# Altium project pca10156.PrjPCB (part 2 of 4)

## Sheet pca10156_sheet3_debugger.SchDoc: =BoardTitle+' - Debugger'
size A3; Organization: Nordic Semiconductor; DocumentNumber: 3; Revision: 1.0.0; SheetNumber: 3; SheetTotal: 8; Author: STL1; CompanyName: Nordic Semiconductor; DrawnBy: STL1; DocumentSize: A4
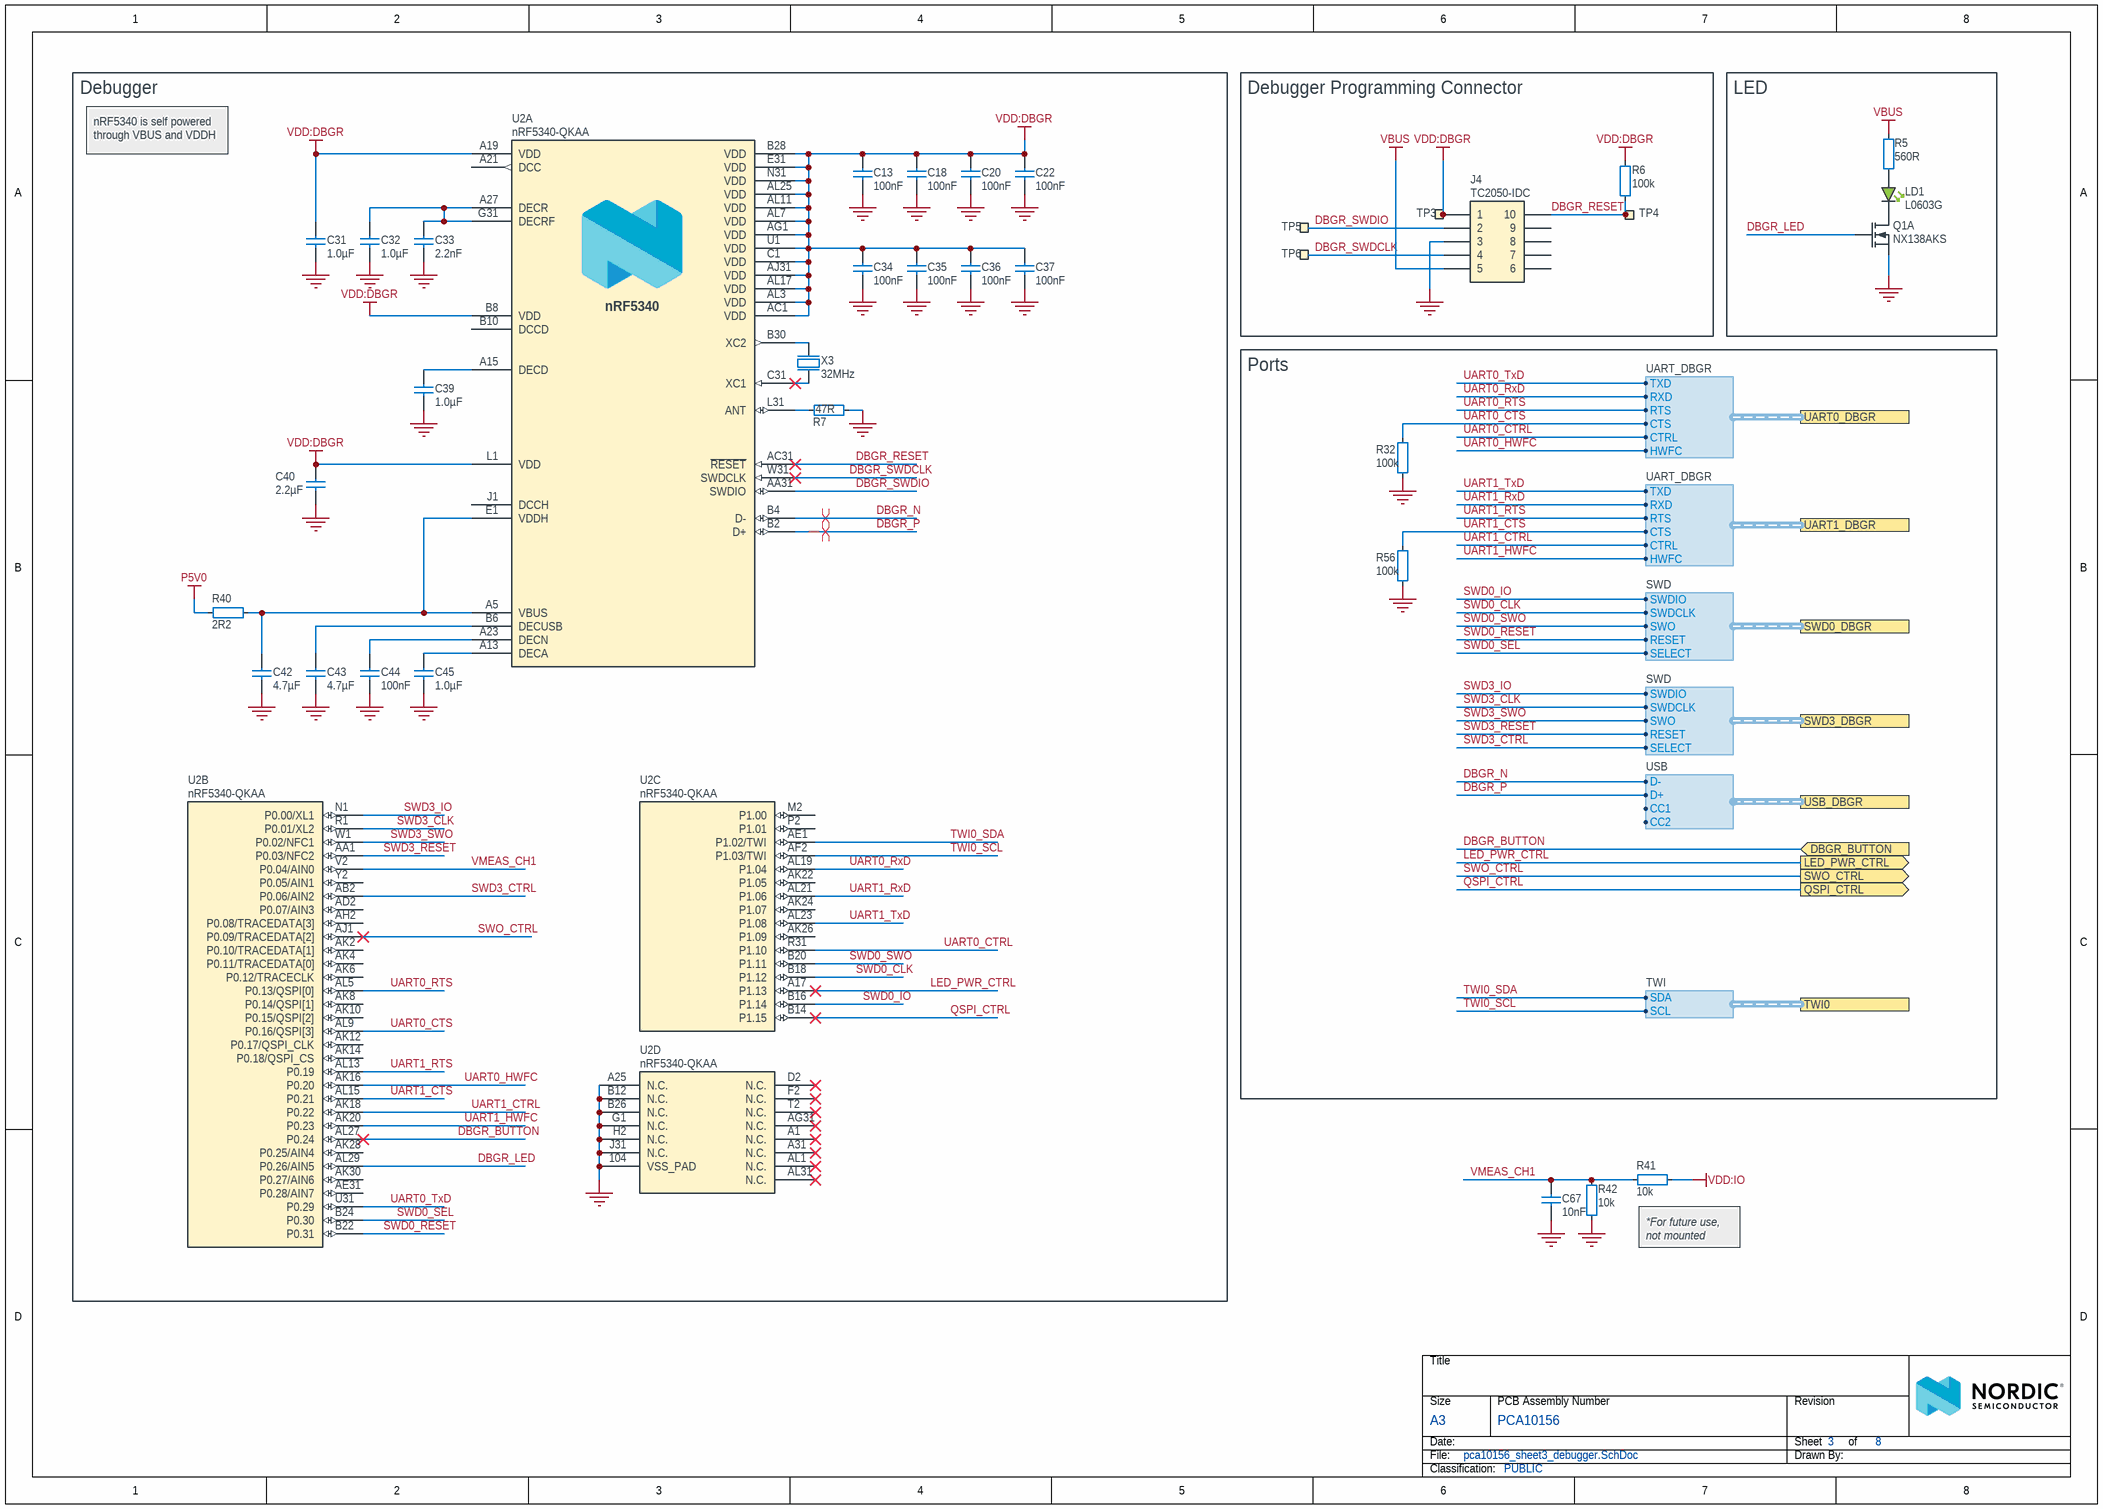
[diagram p2: pca10156_sheet3_debugger.SchDoc]

### Parts
C13  100nF  [CAPC0603X03L_C]
C18  100nF  [CAPC0603X03L_C]
C20  100nF  [CAPC0603X03L_C]
C22  100nF  [CAPC0603X03L_C]
C31  1.0µF  [CAPC1005X04L]
C32  1.0µF  [CAPC1005X04L]
C33  2.2nF  [CAPC0603X03L_C]
C34  100nF  [CAPC0603X03L_C]
C35  100nF  [CAPC0603X03L_C]
C36  100nF  [CAPC0603X03L_C]
C37  100nF  [CAPC0603X03L_C]
C39  1.0µF  [CAPC1005X04L]
C40  2.2µF  [CAPC1608X06L]
C42  4.7µF  [CAPC1608X06L]
C43  4.7µF  [CAPC1608X06L]
C44  100nF  [CAPC0603X03L_C]
C45  1.0µF  [CAPC1005X04L]
C67  10nF  [CAPC0603X03L_C]
J4  TC2050-IDC  [TC2050-IDC-NLFP]  (no BOM)
LD1  L0603G  [LED_0603_G]
Q1  NX138AKS  [TSSOP6]  (part A of 2)
R5  560R  [RESC0603X03L_C]
R6  100k  [RESC0603X03L_C]
R7  47R  [RESC0603X03L_C]
R32  100k  [RESC0603X03L_C]
R40  2R2  [RESC0603X03L_C]
R41  10k  [RESC0603X03L_C]
R42  10k  [RESC0603X03L_C]
R56  100k  [RESC0603X03L_C]
TP3  Ø1.5mm,SMD  [TP_SMD_D1.5mm]  (value not drawn)  (no BOM)
TP4  Ø1.5mm,SMD  [TP_SMD_D1.5mm]  (value not drawn)  (no BOM)
TP5  Ø1.5mm,SMD  [TP_SMD_D1.5mm]  (value not drawn)  (no BOM)
TP6  Ø1.5mm,SMD  [TP_SMD_D1.5mm]  (value not drawn)  (no BOM)
U2  nRF5340-QKAA  [AQFN40P700X700X85_HS-99N]  (parts A,B,C,D of 4)
X3  32MHz  [BT-XTAL_2016]

### Blocks framed on the sheet
Debugger: C13 C18 C20 C22 C31-C37 C39 C40 C42-C45 R7 R40 U2 X3
Debugger Programming Connector: J4 R6 TP3-TP6
LED: LD1 Q1 R5
Ports: R32 R56

### Ports
DBGR_BUTTON (in), LED_PWR_CTRL (out), QSPI_CTRL (out), SWD0_DBGR (harness SWD), SWD3_DBGR (harness SWD), SWO_CTRL (out), TWI0 (harness TWI), UART0_DBGR (harness UART_DBGR), UART1_DBGR (harness UART_DBGR), USB_DBGR (harness USB)

### Harnesses
SWD: SWDIO, SWDCLK, SWO, RESET, SELECT
UART_DBGR: RTS, CTS, RXD, TXD, HWFC, CTRL
TWI: SCL, SDA
USB: D+, D-, CC1, CC2

### Nets
GND: C13.2 C18.2 C20.2 C22.2 C31.2 C32.1 C33.2 C34.2 C35.2 C36.2 C37.2 C39.1 C40.2 C42.2 C43.2 C44.2 C45.1 C67.2 J4.3 Q1.1(S1) R7.2 R32.2 R42.1 R56.2 U2.104(VSS_PAD) U2.A25(N.C.) U2.B12(N.C.) U2.B26(N.C.) U2.G1(N.C.) U2.H2(N.C.) U2.J31(N.C.) X3.2(GND) X3.4(GND)
P5V0: R40.2
VBUS: J4.5 R5.2
VDD:DBGR: C13.1 C18.1 C20.1 C22.1 C31.1 C34.1 C35.1 C36.1 C37.1 C40.1 J4.1 R6.2 TP3.1 U2.A19(VDD) U2.AC1(VDD) U2.AG1(VDD) U2.AJ31(VDD) U2.AL3(VDD) U2.AL7(VDD) U2.AL11(VDD) U2.AL17(VDD) U2.AL25(VDD) U2.B8(VDD) U2.B28(VDD) U2.C1(VDD) U2.E31(VDD) U2.L1(VDD) U2.N31(VDD) U2.U1(VDD)
VDD:IO: R41.2
DBGR_BUTTON: U2.AL27(P0.24) ; port DBGR_BUTTON
DBGR_LED: Q1.2(G1) U2.AL29(P0.26/AIN5)
DBGR_N: U2.B4(D-) ; port USB_DBGR.D-
DBGR_P: U2.B2(D+) ; port USB_DBGR.D+
DBGR_RESET: J4.10 R6.1 TP4.1 U2.AC31(~{RESET})
DBGR_SWDCLK: J4.4 TP6.1 U2.W31(SWDCLK)
DBGR_SWDIO: J4.2 TP5.1 U2.AA31(SWDIO)
LED_PWR_CTRL: U2.A17(P1.13) ; port LED_PWR_CTRL
QSPI_CTRL: U2.B14(P1.15) ; port QSPI_CTRL
SWD0_CLK: U2.B18(P1.12) ; port SWD0_DBGR.SWDCLK
SWD0_IO: U2.B16(P1.14) ; port SWD0_DBGR.SWDIO
SWD0_RESET: U2.B22(P0.31) ; port SWD0_DBGR.RESET
SWD0_SEL: U2.B24(P0.30) ; port SWD0_DBGR.SELECT
SWD0_SWO: U2.B20(P1.11) ; port SWD0_DBGR.SWO
SWD3_CLK: U2.R1(P0.01/XL2) ; port SWD3_DBGR.SWDCLK
SWD3_CTRL: U2.AB2(P0.06/AIN2) ; port SWD3_DBGR.SELECT
SWD3_IO: U2.N1(P0.00/XL1) ; port SWD3_DBGR.SWDIO
SWD3_RESET: U2.AA1(P0.03/NFC2) ; port SWD3_DBGR.RESET
SWD3_SWO: U2.W1(P0.02/NFC1) ; port SWD3_DBGR.SWO
SWO_CTRL: U2.AJ1(P0.09/TRACEDATA[2]) ; port SWO_CTRL
TWI0_SCL: U2.AF2(P1.03/TWI) ; port TWI0.SCL
TWI0_SDA: U2.AE1(P1.02/TWI) ; port TWI0.SDA
UART0_CTRL: U2.R31(P1.10) ; port UART0_DBGR.CTRL
UART0_CTS: R32.1 U2.AL9(P0.16/QSPI[3]) ; port UART0_DBGR.CTS
UART0_HWFC: U2.AK16(P0.20) ; port UART0_DBGR.HWFC
UART0_RTS: U2.AL5(P0.13/QSPI[0]) ; port UART0_DBGR.RTS
UART0_RxD: U2.AL19(P1.04) ; port UART0_DBGR.RXD
UART0_TxD: U2.U31(P0.29) ; port UART0_DBGR.TXD
UART1_CTRL: U2.AK18(P0.22) ; port UART1_DBGR.CTRL
UART1_CTS: R56.1 U2.AL15(P0.21) ; port UART1_DBGR.CTS
UART1_HWFC: U2.AK20(P0.23) ; port UART1_DBGR.HWFC
UART1_RTS: U2.AL13(P0.19) ; port UART1_DBGR.RTS
UART1_RxD: U2.AL21(P1.06) ; port UART1_DBGR.RXD
UART1_TxD: U2.AL23(P1.08) ; port UART1_DBGR.TXD
VMEAS_CH1: C67.1 R41.1 R42.2 U2.V2(P0.04/AIN0)
NetC32_2: C32.2 C33.1 U2.A27(DECR) U2.G31(DECRF)
NetC39_2: C39.2 U2.A15(DECD)
NetC42_1: C42.1 R40.1 U2.A5(VBUS) U2.E1(VDDH)
NetC43_1: C43.1 U2.B6(DECUSB)
NetC44_1: C44.1 U2.A23(DECN)
NetC45_2: C45.2 U2.A13(DECA)
NetLD1_1: LD1.1(C) Q1.6(D1)
NetLD1_2: LD1.2(A) R5.1
NetR7_1: R7.1 U2.L31(ANT)
NetU2_B30: U2.B30(XC2) X3.3(out)
NetU2_C31: U2.C31(XC1) X3.1(inp)

Not connected (* = marked no-connect by the designer): J4 6 7 8 9; U2 A1(N.C.)* A21(DCC) A31(N.C.)* AD2(P0.07/AIN3) AE31(P0.28/AIN7) AG31(N.C.)* AH2(P0.08/TRACEDATA[3]) AK2(P0.10/TRACEDATA[1]) AK4(P0.11/TRACEDATA[0]) AK6(P0.12/TRACECLK) AK8(P0.14/QSPI[1]) AK10(P0.15/QSPI[2]) AK12(P0.17/QSPI_CLK) AK14(P0.18/QSPI_CS) AK22(P1.05) AK24(P1.07) AK26(P1.09) AK28(P0.25/AIN4) AK30(P0.27/AIN6) AL1(N.C.)* AL31(N.C.)* B10(DCCD) D2(N.C.)* F2(N.C.)* J1(DCCH) M2(P1.00) P2(P1.01) T2(N.C.)* Y2(P0.05/AIN1)

### Layout directives
differential pair; differential pair class DBGR; net class DBGR_USB: DBGR_N, DBGR_P

### Notes on the sheet
- nRF5340 is self powered through VBUS and VDDH
- (near R41) *For future use, not mounted
- Title
- Size
- Date:
- File:
- A3
- PCB Assembly Number
- Sheet
- Drawn By:
- Revision
- of
- Classification:
- (in symbol nRF5340-QKAAD0, part A) nRF5340

### Library data of the parts
C13 C18 C20 C22 C34-C37 C44 = C0201-100n: Capacitor, X5R, ±10%; Manufacturer: N.A.; Part number IPS: 00000001248, 00000002505; Part number Norautron: 262071862; Part number NEMS: 100200078; Pad Count: 2; Note: 16V; Component Status: Active; Part Number: C0201-100n; Value: 100nF; Footprint Doc: 0201; Component Class: Capacitors; Author: rsk; PartId: 100200078; Manufacturer Part Number: N.A.; ComponentLink1URL: N.A.; ComponentLink1Description: Datasheet; ComponentLink2URL: N.A.; ComponentLink2Description: Supplier link; HelpURL: N.A.; LatestRevisionDate: 2017-11-09; Published: 2014-11-13; Supplier 1: N.A.; Supplier Part Number 1: N.A.; Supplier 2: N.A.; Supplier Part Number 2: N.A.; Artikkelnr Noca: N.A.
C31 C32 C39 C45 = C0402-1µ0-6.3V-X5R-10%: Capacitor, X5R, ±10%, 6.3V; Manufacturer: N.A.; Part number Norautron: 26207137; Part number NEMS: 100200498; Pad Count: 2; Component Status: Active; Part Number: C0402-1µ0-6.3V-X5R-10%; Manufacturer Part Number: N.A.; LatestRevisionDate: 2022-01-27; Published: 2022-01-27; Value: 1.0µF; Note: 6.3V; Artikkelnr Noca: N.A.; Footprint Doc: 0402; ComponentLink1URL: N.A.; ComponentLink1Description: Datasheet; ComponentLink2URL: N.A.; ComponentLink2Description: Supplier link; HelpURL: N.A.; Supplier 1: N.A.; Supplier Part Number 1: N.A.; Supplier 2: N.A.; Supplier Part Number 2: N.A.; Part number IPS: N.A.; Component Class: Capacitors; PartId: 100200498; Author: rubr
C33 = C0201-2n2: Capacitor, X7R, ±10%, 10V; Manufacturer: N.A.; Part number IPS: 00000001778; Part number Norautron: 26470002; Part number NEMS: 100200060; Pad Count: 2; Component Status: Active; Part Number: C0201-2n2; LatestRevisionDate: 2014-11-13; Published: 2014-11-13; Value: 2.2nF; Footprint Doc: 0201; Manufacturer Part Number: N.A.; ComponentLink1URL: N.A.; ComponentLink1Description: Datasheet; ComponentLink2URL: N.A.; ComponentLink2Description: Supplier link; HelpURL: N.A.; Note: 10V; Supplier 1: N.A.; Supplier Part Number 1: N.A.; Supplier 2: N.A.; Supplier Part Number 2: N.A.; Artikkelnr Noca: N.A.; Component Class: Capacitors; PartId: 100200060; Author: rsk
C40 = C0603-2µ2-6.3V-X7R: Capacitor, X7R, ±10%, 6.3V; Manufacturer: N.A.; Part number NEMS: 100200272; Artikkelnr Noca: 20039322; Pad Count: 2; Component Status: Active; Part Number: C0603-2µ2-6.3V-X7R; Manufacturer Part Number: N.A.; LatestRevisionDate: 2021-07-22; Published: 2009-05-08; Value: 2.2µF; Note: 6.3V; Footprint Doc: 0603; ComponentLink1URL: N.A.; ComponentLink1Description: Datasheet; ComponentLink2URL: N.A.; ComponentLink2Description: Supplier link; HelpURL: N.A.; Supplier 1: N.A.; Supplier Part Number 1: N.A.; Supplier 2: N.A.; Supplier Part Number 2: N.A.; Part number IPS: N.A.; Component Class: Capacitors; PartId: 100200272; Author: rsk; Part number Norautron: N.A.
C42 C43 = C0603-4µ7-10V-X7S: Capacitor, X7S, ±10%, 10V; Manufacturer: N.A.; Part number IPS: 00000001779; Part number NEMS: 100200351; Pad Count: 2; Artikkelnr Noca: 20030013; Component Status: Active; Part Number: C0603-4µ7-10V-X7S; Value: 4.7µF; Footprint Doc: 0603; Component Class: Capacitors; Author: rsk; PartId: 100200351; Manufacturer Part Number: N.A.; ComponentLink1URL: N.A.; ComponentLink1Description: Datasheet; ComponentLink2URL: N.A.; ComponentLink2Description: Supplier link; HelpURL: N.A.; LatestRevisionDate: 2016-08-15; Published: 2016-08-15; Note: 10V; Supplier 1: Digi-Key; Supplier Part Number 1: 445-14258-1-ND; Supplier 2: N.A.; Supplier Part Number 2: N.A.; Part number Norautron: N.A.
C67 = C0201-10n: Capacitor, X7R, ±10%; Manufacturer: N.A.; Part number IPS: 00000003480; Part number Norautron: 26621779; Part number NEMS: 100200067; Note: 10V; Assembly: Not Mounted; Pad Count: 2; Component Status: Active; Part Number: C0201-10n; Manufacturer Part Number: N.A.; LatestRevisionDate: 2017-11-09; Published: 2014-11-13; Value: 10nF; Artikkelnr Noca: N.A.; Footprint Doc: 0201; ComponentLink1URL: N.A.; ComponentLink1Description: Datasheet; ComponentLink2URL: N.A.; ComponentLink2Description: Supplier link; HelpURL: N.A.; Supplier 1: N.A.; Supplier Part Number 1: N.A.; Supplier 2: N.A.; Supplier Part Number 2: N.A.; Component Class: Capacitors; PartId: 100200067; Author: rsk
J4 = TC2050-IDC-NLFP: CBL PLUG-OF-NAILS 10-PIN; Manufacturer: Tag-Connect LLC; Part number NEMS: 100500463; Artikkelnr Noca: N.A.; Pad Count: 10; Component Status: Active; System: Connector; Part Number: TC2050-IDC-NLFP; Manufacturer Part Number: TC2050-IDC-NLFP; LatestRevisionDate: 2012-11-21; Published: 2012-11-21; Value: TC2050-IDC; Footprint Doc: TC2050-IDC-NLFP; Part number IPS: N.A.; ComponentLink1URL: N.A.; ComponentLink1Description: Datasheet; ComponentLink2URL: N.A.; ComponentLink2Description: Supplier link; HelpURL: http://www.tag-connect.com/Materials/TC2050-IDC%20Datasheet.pdf; Supplier 1: Digi-Key; Supplier Part Number 1: TC2050-IDC-NL-ND; Supplier 2: N.A.; Supplier Part Number 2: N.A.; Component Class: Connectors; Note: N.A.; PartId: 100500463; Author: rsk; Part number Norautron: N.A.
LD1 = VS 25C7M5: LED, Green, 0603, 573nm, Vf=2.0V, 24mcd, - 40 to +85°C; Manufacturer: Victory Electronics; Part number IPS: 00000001274, 00000009961; Part number Norautron: 26313411; Part number NEMS: 101400097; Pad Count: 2; Note: N.A.; Artikkelnr Noca: 13019193; Component Status: Active; Part Number: VS 25C7M5; PartId: 101400097; Component Class: Optoelectronics; Author: rsk; Manufacturer Part Number: VS 25C7M5; ComponentLink1URL: N.A.; ComponentLink1Description: Datasheet; ComponentLink2URL: N.A.; ComponentLink2Description: Supplier link; HelpURL: \\hizz\pro\app9717\Datasheet\optoelectronics\Victory Electronics\VS 25C7M5.pdf; Footprint Doc: 0603; LatestRevisionDate: 2020-10-23; Published: 2017-08-21; Value: L0603G; Supplier 1: EC Partner; Supplier Part Number 1: N.A.; Supplier 2: N.A.; Supplier Part Number 2: N.A.
Q1 = NX138AKS: MOSFET 2N-CH 60V 0.17A TSSOP6 (SOT363); Manufacturer: Nexperia; Manufacturer Part Number: NX138AKSX; Part number NEMS: 101300207; Component Status: Active; Pad Count: 6; Note: N.A.; Part Number: NX138AKS; Component Class: Semiconductors; Author: stl1; ComponentLink1URL: https://assets.nexperia.com/documents/data-sheet/NX138AKS.pdf; ComponentLink1Description: Datasheet; ComponentLink2URL: N.A.; ComponentLink2Description: Supplier link; HelpURL: N.A.; LatestRevisionDate: 2023-11-20; Published: 2023-11-20; Footprint Doc: TSSOP6; Value: NX138AKS; Supplier 1: Digi-Key; Supplier Part Number 1: 1727-2732-2-ND; Supplier 2: Mouser; Supplier Part Number 2: 771-NX138AKSX; Artikkelnr Noca: N.A.; Part number IPS: N.A.; Part number Norautron: N.A.; PartId: 101300207
R5 = R0201-560: Resistor, ±1%, 0.05W; Manufacturer: N.A.; Part number NEMS: 100100038; Note: Chip Res 1%; Pad Count: 2; Component Status: Active; Part Number: R0201-560; Manufacturer Part Number: N.A.; ComponentLink1URL: N.A.; ComponentLink1Description: Datasheet; ComponentLink2URL: N.A.; ComponentLink2Description: Supplier link; HelpURL: N.A.; Footprint Doc: 0201; LatestRevisionDate: 2014-11-13; Published: 2014-11-13; Value: 560R; Supplier 1: N.A.; Supplier Part Number 1: N.A.; Supplier 2: N.A.; Supplier Part Number 2: N.A.; Artikkelnr Noca: N.A.; Part number IPS: N.A.; PartId: 100100038; Component Class: Resistors; Author: rsk; Part number Norautron: N.A.
R6 R32 R56 = R0201-100k: Resistor, ±1%, 0.05W; Manufacturer: N.A.; Part number IPS: 00000001419; Part number Norautron: 26108487; Part number NEMS: 100100080; Note: Chip Res 1%; Pad Count: 2; Component Status: Active; Part Number: R0201-100k; Manufacturer Part Number: N.A.; ComponentLink1URL: N.A.; ComponentLink1Description: Datasheet; ComponentLink2URL: N.A.; ComponentLink2Description: Supplier link; HelpURL: N.A.; Footprint Doc: 0201; LatestRevisionDate: 2014-11-13; Published: 2014-11-13; Value: 100k; Artikkelnr Noca: N.A.; Supplier 1: N.A.; Supplier Part Number 1: N.A.; Supplier 2: N.A.; Supplier Part Number 2: N.A.; Component Class: Resistors; PartId: 100100080; Author: rsk
R7 = R0201-47R: Resistor, ±1%, 0.05W; Manufacturer: N.A.; Part number IPS: 00000004794; Part number Norautron: 26108300; Part number NEMS: 100100022; Component Status: Active; Pad Count: 2; Note: Chip Res 1%; Part Number: R0201-47R; PartId: 100100022; Component Class: Resistors; Author: rsk; Manufacturer Part Number: N.A.; ComponentLink1URL: N.A.; ComponentLink1Description: Datasheet; ComponentLink2URL: N.A.; ComponentLink2Description: Supplier link; HelpURL: N.A.; LatestRevisionDate: 2014-11-13; Published: 2014-11-13; Footprint Doc: 0201; Value: 47R; Supplier 1: N.A.; Supplier Part Number 1: N.A.; Supplier 2: N.A.; Supplier Part Number 2: N.A.; Artikkelnr Noca: N.A.
R40 = R0201-2R2: Resistor, ±1%, 0.05W; Manufacturer: N.A.; Part number Norautron: 26470029; Part number NEMS: 100100006; Pad Count: 2; Note: Chip Res 1%; Component Status: Active; Part Number: R0201-2R2; Footprint Doc: 0201; Value: 2R2; Component Class: Resistors; Author: rsk; PartId: 100100006; Manufacturer Part Number: N.A.; ComponentLink1URL: N.A.; ComponentLink1Description: Datasheet; ComponentLink2URL: N.A.; ComponentLink2Description: Supplier link; HelpURL: N.A.; LatestRevisionDate: 2014-11-13; Published: 2014-11-13; Supplier 1: N.A.; Supplier Part Number 1: N.A.; Supplier 2: N.A.; Supplier Part Number 2: N.A.; Artikkelnr Noca: N.A.; Part number IPS: N.A.
R41 R42 = R0201-10k: Resistor, ±1%, 0.05W; Manufacturer: N.A.; Part number IPS: 00000001255; Part number Norautron: 26107101; Part number NEMS: 100100065; Component Status: Active; Pad Count: 2; Note: Chip Res 1%; Part Number: R0201-10k; PartId: 100100065; Component Class: Resistors; Author: rsk; Manufacturer Part Number: N.A.; ComponentLink1URL: N.A.; ComponentLink1Description: Datasheet; ComponentLink2URL: N.A.; ComponentLink2Description: Supplier link; HelpURL: N.A.; LatestRevisionDate: 2014-11-13; Published: 2014-11-13; Footprint Doc: 0201; Value: 10k; Supplier 1: N.A.; Supplier Part Number 1: N.A.; Supplier 2: N.A.; Supplier Part Number 2: N.A.; Artikkelnr Noca: N.A.
TP3-TP6 = TP_SMD_Ø1.5MM: 1.5mm circular SMD testpad; Manufacturer: Nordic Semiconductor; Manufacturer Part Number: N.A.; Part number NEMS: 100500477; Pad Count: 1; Component Status: Active; Part Number: TP_SMD_Ø1.5MM; ComponentLink1URL: N.A.; ComponentLink1Description: Datasheet; ComponentLink2URL: N.A.; ComponentLink2Description: Supplier link; HelpURL: N.A.; Footprint Doc: TP_SMD_Ø1.5mm; LatestRevisionDate: 2021-03-05; Published: 2016-06-02; Value: Ø1.5mm,SMD; Note: N.A.; Artikkelnr Noca: N.A.; Part number IPS: N.A.; Supplier 1: N.A.; Supplier Part Number 1: N.A.; Supplier 2: N.A.; Supplier Part Number 2: N.A.; Component Class: Connectors; PartId: 100500477; Author: rsk; Part number Norautron: N.A.
U2 = nRF5340-QKAAD0: Multi-protocol Bluetooth Low Energy, IEEE 802.15.4, ANT and 2.4GHz proprietary system-on-chip; Manufacturer: Nordic Semiconductor; Part number Norautron: NOD26470035; Part number NEMS: 102000216; Pad Count: 98; Note: N.A.; Component Status: Active; Part Number: nRF5340-QKAAD0; Footprint Doc: AQFN-98; Value: nRF5340-QKAA; Component Class: Nordic_Devices; Author: rsk; PartId: 102000216; Manufacturer Part Number: nRF5340-QKAAD0; ComponentLink1URL: N.A.; ComponentLink1Description: Datasheet; ComponentLink2URL: N.A.; ComponentLink2Description: Supplier link; HelpURL: N.A.; LatestRevisionDate: 2020-12-02; Published: 2020-12-02; Supplier 1: Nordic Semiconductor; Supplier Part Number 1: nRF5340-QKAAD0; Supplier 2: N.A.; Supplier Part Number 2: N.A.; Artikkelnr Noca: N.A.; Part number IPS: N.A.
X3 = XTAL_SMD2016_32MHz_8pF_Golledge: XTAL SMD 2016, 32MHz, Cl=8pF, Tol: ±10ppm, Stab: ±15ppm; Manufacturer Part Number: MP06003; Part number IPS: 00000001431; Part number Norautron: N.A.; Part number NEMS: 101600041; Component Status: Active; Pad Count: 4; Note: XTAL SMD 32.000MHz; Artikkelnr Noca: 22010050; Part Number: XTAL_SMD2016_32MHz_8pF_Golledge; PartId: 101600041; Component Class: Oscillators; Author: rsk; Manufacturer: Golledge; ComponentLink1URL: N.A.; ComponentLink1Description: Datasheet; ComponentLink2URL: N.A.; ComponentLink2Description: Supplier link; HelpURL: \\hizz\pro\app9717\Datasheet\crystals\Golledge\mp06003.pdf; LatestRevisionDate: 2016-11-02; Published: 2016-11-02; Footprint Doc: XTAL_2016; Value: 32MHz; Supplier 1: Link Nordic; Supplier Part Number 1: N.A.; Supplier 2: N.A.; Supplier Part Number 2: N.A.

## Sheet pca10156_sheet4_level_shifters.SchDoc: =BoardTitle+' - Level Shifters'
size A3; Organization: Nordic Semiconductor; DocumentNumber: 4; Revision: 1.0.0; SheetNumber: 4; SheetTotal: 8; Author: STL1; CompanyName: Nordic Semiconductor; DrawnBy: STL1; DocumentSize: A4
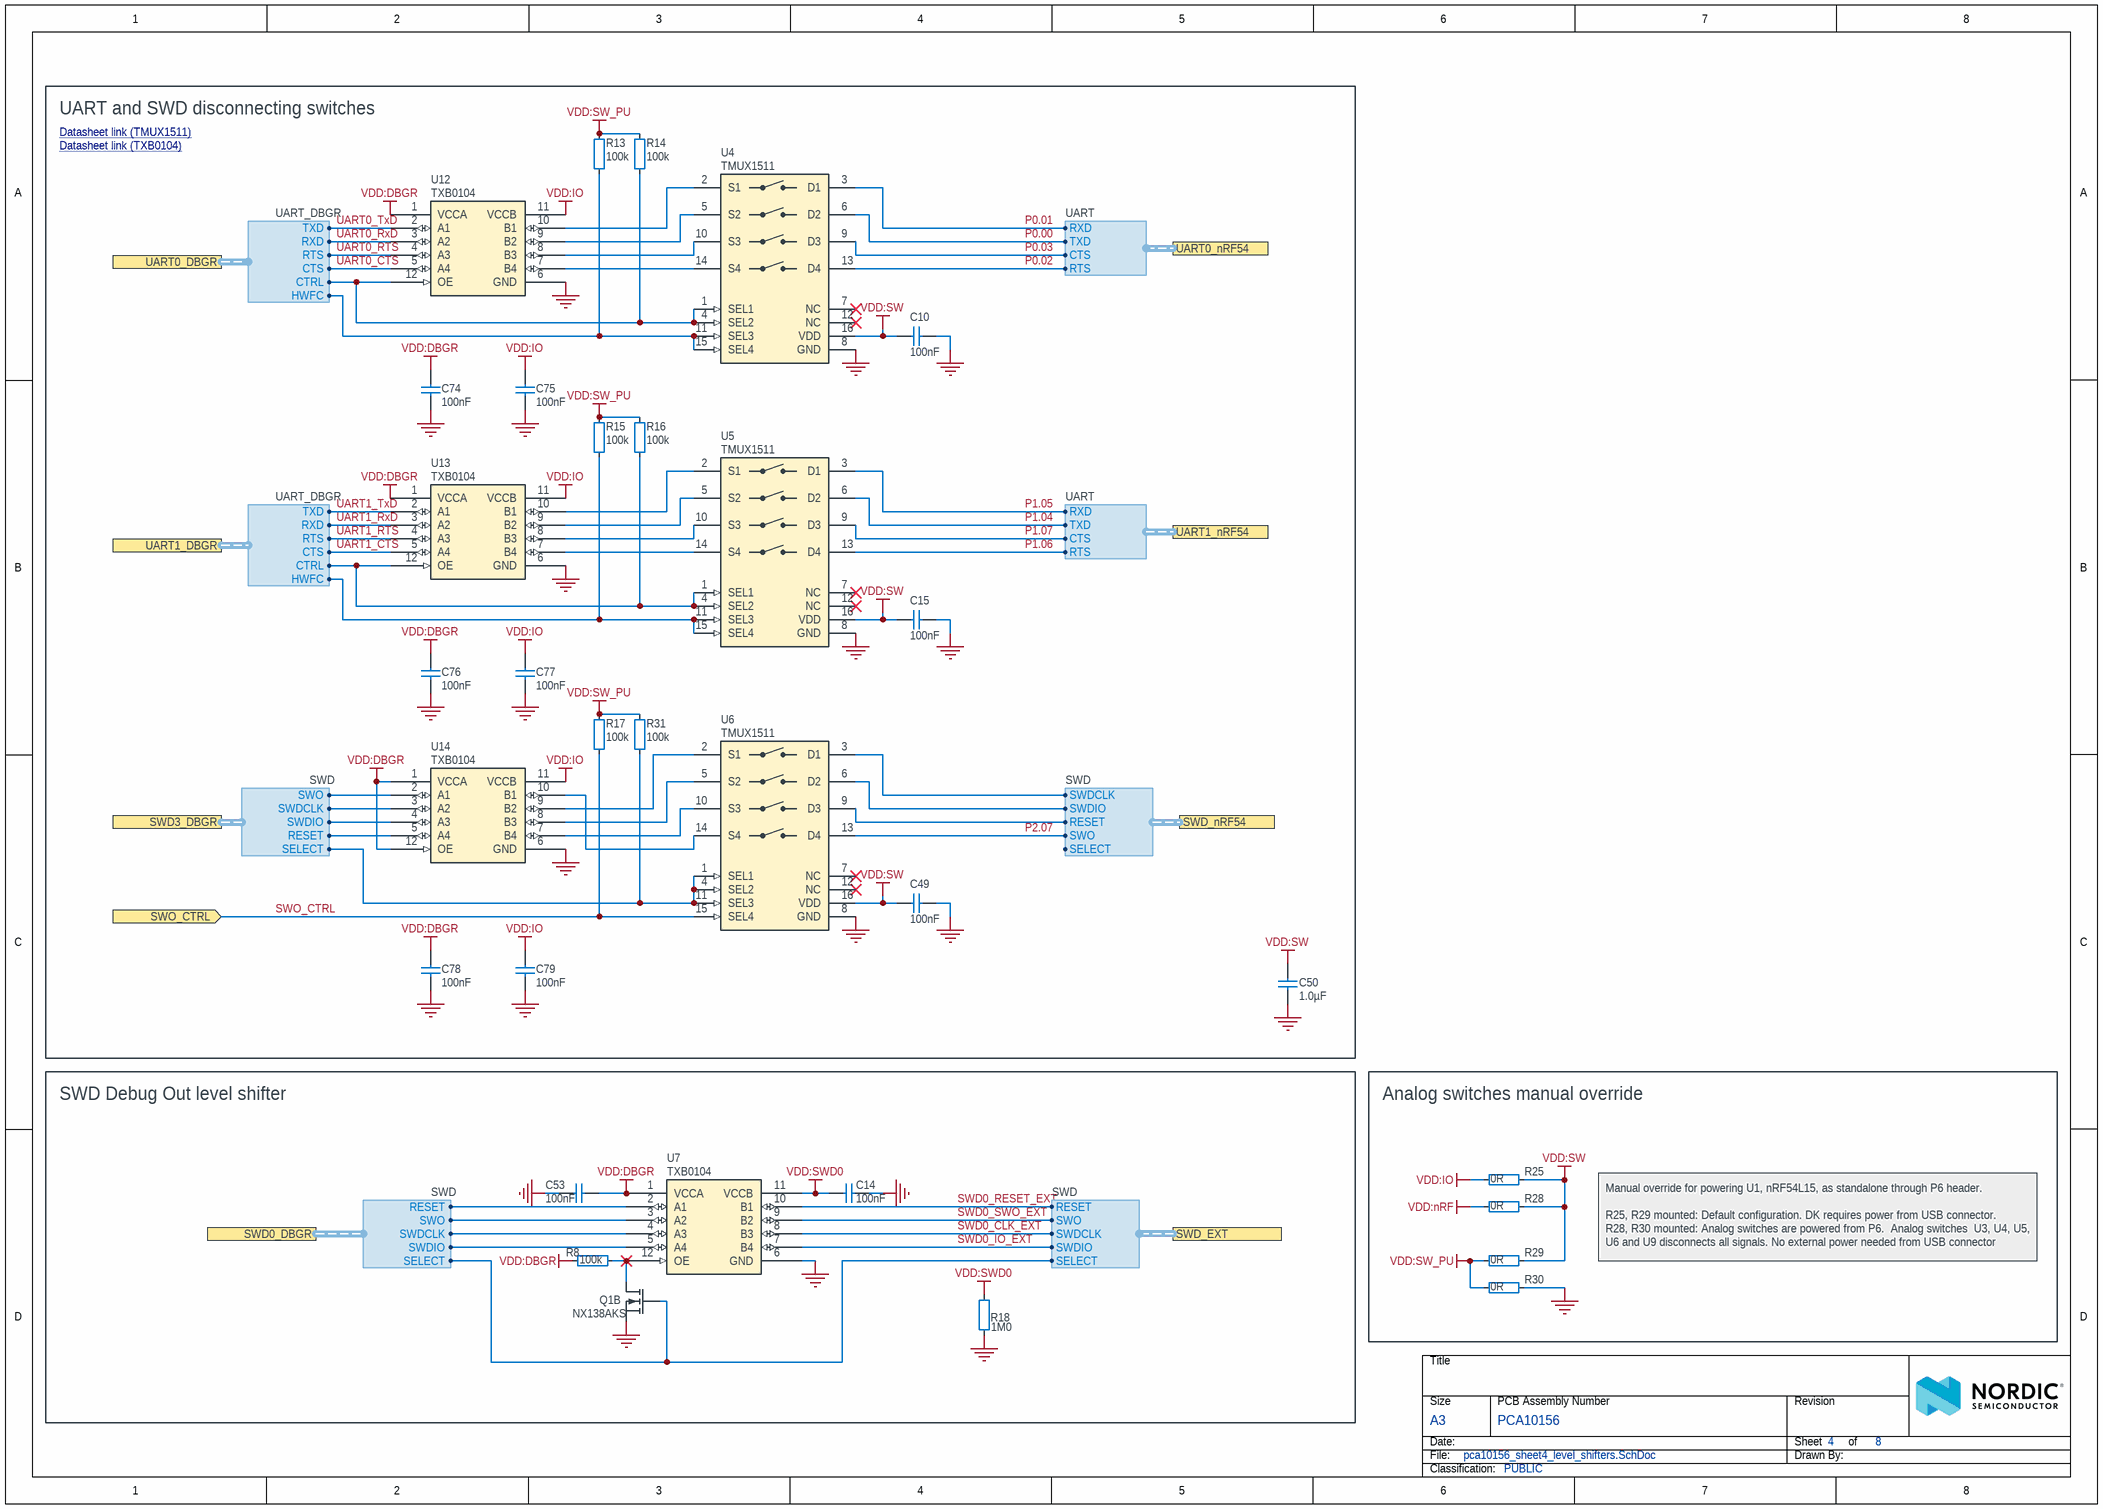
[diagram p3: pca10156_sheet4_level_shifters.SchDoc]

### Parts
C10  100nF  [CAPC0603X03L_C]
C14  100nF  [CAPC0603X03L_C]
C15  100nF  [CAPC0603X03L_C]
C49  100nF  [CAPC0603X03L_C]
C50  1.0µF  [CAPC1005X04L]
C53  100nF  [CAPC0603X03L_C]
C74  100nF  [CAPC0603X03L_C]
C75  100nF  [CAPC0603X03L_C]
C76  100nF  [CAPC0603X03L_C]
C77  100nF  [CAPC0603X03L_C]
C78  100nF  [CAPC0603X03L_C]
C79  100nF  [CAPC0603X03L_C]
Q1  NX138AKS  [TSSOP6]  (part B of 2)
R8  100k  [RESC0603X03L_C]
R13  100k  [RESC0603X03L_C]
R14  100k  [RESC0603X03L_C]
R15  100k  [RESC0603X03L_C]
R16  100k  [RESC0603X03L_C]
R17  100k  [RESC0603X03L_C]
R18  1M0  [RESC0603X03L_C]
R25  0R  [RESC1005X04L]
R28  0R  [RESC1005X04L]
R29  0R  [RESC1005X04L]
R30  0R  [RESC1005X04L]
R31  100k  [RESC0603X03L_C]
U4  TMUX1511  [XQFN40P180X260X50-16N]
U5  TMUX1511  [XQFN40P180X260X50-16N]
U6  TMUX1511  [XQFN40P180X260X50-16N]
U7  TXB0104  [QFN12P40_170X200X55L50X20]
U12  TXB0104  [QFN12P40_170X200X55L50X20]
U13  TXB0104  [QFN12P40_170X200X55L50X20]
U14  TXB0104  [QFN12P40_170X200X55L50X20]

### Blocks framed on the sheet
UART and SWD disconnecting switches: C10 C15 C49 C50 C74-C79 R13-R17 R31 U4-U6 U12-U14
SWD Debug Out level shifter: C14 C53 Q1 R8 R18 U7
Analog switches manual override: R25 R28-R30

### Ports
SWD0_DBGR (harness SWD), SWD3_DBGR (harness SWD), SWD_EXT (harness SWD), SWD_nRF54 (harness SWD), SWO_CTRL (in), UART0_DBGR (harness UART_DBGR), UART0_nRF54 (harness UART), UART1_DBGR (harness UART_DBGR), UART1_nRF54 (harness UART)

### Harnesses
SWD: SWDIO, SWDCLK, SWO, RESET, SELECT
UART: RTS, CTS, RXD, TXD
UART_DBGR: RTS, CTS, RXD, TXD, HWFC, CTRL

### Nets
GND: C10.2 C14.2 C15.2 C49.2 C50.1 C53.1 C74.2 C75.2 C76.2 C77.2 C78.2 C79.2 Q1.4(S2) R18.1 R30.2 U4.8(GND) U5.8(GND) U6.8(GND) U7.6(GND) U12.6(GND) U13.6(GND) U14.6(GND)
VDD:DBGR: C53.2 C74.1 C76.1 C78.1 R8.2 U7.1(VCCA) U12.1(VCCA) U13.1(VCCA) U14.1(VCCA) U14.12(OE)
VDD:IO: C75.1 C77.1 C79.1 R25.1 U12.11(VCCB) U13.11(VCCB) U14.11(VCCB)
VDD:nRF: R28.1
VDD:SW: C10.1 C15.1 C49.1 C50.2 R25.2 R28.2 R29.2 U4.16(VDD) U5.16(VDD) U6.16(VDD)
VDD:SW_PU: R13.1 R14.1 R15.1 R16.1 R17.2 R29.1 R30.1 R31.1
VDD:SWD0: C14.1 R18.2 U7.11(VCCB)
nRF54_RESET: U6.9(D3) ; port SWD_nRF54.RESET
P0.00: U4.6(D2) ; port UART0_nRF54.TXD
P0.01: U4.3(D1) ; port UART0_nRF54.RXD
P0.02: U4.13(D4) ; port UART0_nRF54.RTS
P0.03: U4.9(D3) ; port UART0_nRF54.CTS
P1.04: U5.6(D2) ; port UART1_nRF54.TXD
P1.05: U5.3(D1) ; port UART1_nRF54.RXD
P1.06: U5.13(D4) ; port UART1_nRF54.RTS
P1.07: U5.9(D3) ; port UART1_nRF54.CTS
P2.07: U6.13(D4) ; port SWD_nRF54.SWO
SWD0_CLK: U7.4(A3) ; port SWD0_DBGR.SWDCLK
SWD0_CLK_EXT: U7.8(B3) ; port SWD_EXT.SWDCLK
SWD0_IO: U7.5(A4) ; port SWD0_DBGR.SWDIO
SWD0_IO_EXT: U7.7(B4) ; port SWD_EXT.SWDIO
SWD0_RESET: U7.2(A1) ; port SWD0_DBGR.RESET
SWD0_RESET_EXT: U7.10(B1) ; port SWD_EXT.RESET
SWD0_SEL: Q1.5(G2) ; port SWD0_DBGR.SELECT, port SWD_EXT.SELECT
SWD0_SWO: U7.3(A2) ; port SWD0_DBGR.SWO
SWD0_SWO_EXT: U7.9(B2) ; port SWD_EXT.SWO
SWD3_CLK: U14.3(A2) ; port SWD3_DBGR.SWDCLK
SWD3_CTRL: R31.2 U6.1(SEL1) U6.4(SEL2) U6.11(SEL3) ; port SWD3_DBGR.SELECT
SWD3_IO: U14.4(A3) ; port SWD3_DBGR.SWDIO
SWD3_RESET: U14.5(A4) ; port SWD3_DBGR.RESET
SWD3_SWO: U14.2(A1) ; port SWD3_DBGR.SWO
SWDCLK: U6.3(D1) ; port SWD_nRF54.SWDCLK
SWDIO: U6.6(D2) ; port SWD_nRF54.SWDIO
SWO_CTRL: R17.1 U6.15(SEL4) ; port SWO_CTRL
UART0_CTRL: R14.2 U4.1(SEL1) U4.4(SEL2) U12.12(OE) ; port UART0_DBGR.CTRL
UART0_CTS: U12.5(A4) ; port UART0_DBGR.CTS
UART0_HWFC: R13.2 U4.11(SEL3) U4.15(SEL4) ; port UART0_DBGR.HWFC
UART0_RTS: U12.4(A3) ; port UART0_DBGR.RTS
UART0_RxD: U12.3(A2) ; port UART0_DBGR.RXD
UART0_TxD: U12.2(A1) ; port UART0_DBGR.TXD
UART1_CTRL: R16.2 U5.1(SEL1) U5.4(SEL2) U13.12(OE) ; port UART1_DBGR.CTRL
UART1_CTS: U13.5(A4) ; port UART1_DBGR.CTS
UART1_HWFC: R15.2 U5.11(SEL3) U5.15(SEL4) ; port UART1_DBGR.HWFC
UART1_RTS: U13.4(A3) ; port UART1_DBGR.RTS
UART1_RxD: U13.3(A2) ; port UART1_DBGR.RXD
UART1_TxD: U13.2(A1) ; port UART1_DBGR.TXD
NetQ1_3: Q1.3(D2) R8.1 U7.12(OE)
NetU4_2: U4.2(S1) U12.10(B1)
NetU4_5: U4.5(S2) U12.9(B2)
NetU4_10: U4.10(S3) U12.8(B3)
NetU4_14: U4.14(S4) U12.7(B4)
NetU5_2: U5.2(S1) U13.10(B1)
NetU5_5: U5.5(S2) U13.9(B2)
NetU5_10: U5.10(S3) U13.8(B3)
NetU5_14: U5.14(S4) U13.7(B4)
NetU6_2: U6.2(S1) U14.9(B2)
NetU6_5: U6.5(S2) U14.8(B3)
NetU6_10: U6.10(S3) U14.7(B4)
NetU6_14: U6.14(S4) U14.10(B1)

Not connected (* = marked no-connect by the designer): U4 7(NC)* 12(NC)*; U5 7(NC)* 12(NC)*; U6 7(NC)* 12(NC)*

### Notes on the sheet
- Datasheet link (TMUX1511) <https://www.ti.com/lit/ds/symlink/tmux1511.pdf?ts=1730882090102&ref_url=https%253A%252F%252Fwww.mouser.dk%252F>
- Datasheet link (TXB0104) <https://www.ti.com/lit/ds/symlink/txb0104.pdf?src-supplier=IHS+Markit>
- Manual override for powering U1, nRF54L15, as standalone through P6 header.
  R25, R29 mounted: Default configuration. DK requires power from USB connector.
  R28, R30 mounted: Analog switches are powered from P6.  Analog switches  U3, U4, U5, U6 and U9 disconnects all signals. No external power needed from USB connector
- Title
- Size
- Date:
- File:
- A3
- PCB Assembly Number
- Sheet
- Drawn By:
- Revision
- of
- Classification:

### Library data of the parts
C10 C14 C15 C49 C53 C74-C79 = C0201-100n: as C13 on sheet pca10156_sheet3_debugger; Part Number: C0201-100n; Value: 100nF; Footprint Doc: 0201; Component Class: Capacitors; Author: rsk; PartId: 100200078; Manufacturer Part Number: N.A.; ComponentLink1URL: N.A.; ComponentLink1Description: Datasheet; ComponentLink2URL: N.A.; ComponentLink2Description: Supplier link; HelpURL: N.A.; LatestRevisionDate: 2017-11-09; Published: 2014-11-13; Supplier 1: N.A.; Supplier Part Number 1: N.A.; Supplier 2: N.A.; Supplier Part Number 2: N.A.; Artikkelnr Noca: N.A.
C50 = C0402-1µ0-6.3V-X5R-10%: as C31 on sheet pca10156_sheet3_debugger; Part Number: C0402-1µ0-6.3V-X5R-10%; Manufacturer Part Number: N.A.; LatestRevisionDate: 2022-01-27; Published: 2022-01-27; Value: 1.0µF; Note: 6.3V; Artikkelnr Noca: N.A.; Footprint Doc: 0402; ComponentLink1URL: N.A.; ComponentLink1Description: Datasheet; ComponentLink2URL: N.A.; ComponentLink2Description: Supplier link; HelpURL: N.A.; Supplier 1: N.A.; Supplier Part Number 1: N.A.; Supplier 2: N.A.; Supplier Part Number 2: N.A.; Part number IPS: N.A.; Component Class: Capacitors; PartId: 100200498; Author: rubr
Q1 = NX138AKS: as Q1 on sheet pca10156_sheet3_debugger; Part Number: NX138AKS; Component Class: Semiconductors; Author: stl1; ComponentLink1URL: https://assets.nexperia.com/documents/data-sheet/NX138AKS.pdf; ComponentLink1Description: Datasheet; ComponentLink2URL: N.A.; ComponentLink2Description: Supplier link; HelpURL: N.A.; LatestRevisionDate: 2023-11-20; Published: 2023-11-20; Footprint Doc: TSSOP6; Value: NX138AKS; Supplier 1: Digi-Key; Supplier Part Number 1: 1727-2732-2-ND; Supplier 2: Mouser; Supplier Part Number 2: 771-NX138AKSX; Artikkelnr Noca: N.A.; Part number IPS: N.A.; Part number Norautron: N.A.; PartId: 101300207
R8 R13-R17 R31 = R0201-100k: as R6 on sheet pca10156_sheet3_debugger; Part Number: R0201-100k; Manufacturer Part Number: N.A.; ComponentLink1URL: N.A.; ComponentLink1Description: Datasheet; ComponentLink2URL: N.A.; ComponentLink2Description: Supplier link; HelpURL: N.A.; Footprint Doc: 0201; LatestRevisionDate: 2014-11-13; Published: 2014-11-13; Value: 100k; Artikkelnr Noca: N.A.; Supplier 1: N.A.; Supplier Part Number 1: N.A.; Supplier 2: N.A.; Supplier Part Number 2: N.A.; Component Class: Resistors; PartId: 100100080; Author: rsk
R18 = R0201-1M0: Resistor, ±1%, 0.05W; Manufacturer: N.A.; Part number IPS: 00000001418; Part number Norautron: 26107108; Part number NEMS: 100100093; Component Status: Active; Pad Count: 2; Note: Chip Res 1%; Part Number: R0201-1M0; PartId: 100100093; Component Class: Resistors; Author: rsk; Manufacturer Part Number: N.A.; ComponentLink1URL: N.A.; ComponentLink1Description: Datasheet; ComponentLink2URL: N.A.; ComponentLink2Description: Supplier link; HelpURL: N.A.; LatestRevisionDate: 2014-11-13; Published: 2014-11-13; Footprint Doc: 0201; Value: 1M0; Supplier 1: N.A.; Supplier Part Number 1: N.A.; Supplier 2: N.A.; Supplier Part Number 2: N.A.; Artikkelnr Noca: N.A.
R25 R28-R30 = R0402-0R: Resistor, ±5%, 0.063W; Manufacturer: N.A.; Part number IPS: 00000007128; Part number NEMS: 100100109; Component Status: Active; Pad Count: 2; Note: Chip Res 5%; Artikkelnr Noca: 27049000; Part Number: R0402-0R; PartId: 100100109; Component Class: Resistors; Author: rsk; Manufacturer Part Number: N.A.; ComponentLink1URL: N.A.; ComponentLink1Description: Datasheet; ComponentLink2URL: N.A.; ComponentLink2Description: Supplier link; HelpURL: N.A.; LatestRevisionDate: 2009-11-23; Published: 2009-05-08; Footprint Doc: 0402; Value: 0R; Supplier 1: Farnell; Supplier Part Number 1: 146-9661; Supplier 2: N.A.; Supplier Part Number 2: N.A.; Part number Norautron: N.A.
U4-U6 = TMUX1511: Low-Capacitance, 1:1 (SPST) 4-Channel, analog switch; Manufacturer: Texas Instruments; Manufacturer Part Number: TMUX1511RSVR; Part number NEMS: 101900847; Component Status: Active; Pad Count: 16; Note: N.A.; Part Number: TMUX1511; Component Class: Misc_ICs; Author: stl1; ComponentLink1URL: https://www.ti.com/lit/ds/symlink/tmux1511.pdf?ts=1730882090102&ref_url=https%253A%252F%252Fwww.mouser.dk%252F; ComponentLink1Description: Datasheet; ComponentLink2URL: N.A.; ComponentLink2Description: Supplier link; HelpURL: https://www.ti.com/lit/ds/symlink/tmux1511.pdf?ts=1730882090102&ref_url=https%253A%252F%252Fwww.mouser.dk%252F; LatestRevisionDate: 2024-12-05; Published: 2024-12-05; Footprint Doc: UFQFN-16; Value: TMUX1511; Supplier 1: Digi-Key; Supplier Part Number 1: 296-53443-2-ND; Supplier 2: Mouser; Supplier Part Number 2: 595-TMUX1511RSVR; Artikkelnr Noca: N.A.; Part number IPS: N.A.; Part number Norautron: N.A.; PartId: 101900847
U7 U12-U14 = TXB0104RUTR: 4-Bit Bidirectional Level-Shifter/Voltage Translator with Automatic Direction Sensing; Manufacturer: Texas Instruments; Part number NEMS: 101900856; Component Status: Active; Pad Count: 12; Note: Translator, Bidirectional; Artikkelnr Noca: N.A.; Part Number: TXB0104RUTR; Component Class: Misc_ICs; Author: stl1; Manufacturer Part Number: TXB0104RUTR; ComponentLink1URL: N.A.; ComponentLink1Description: Datasheet; ComponentLink2URL: N.A.; ComponentLink2Description: Supplier link; HelpURL: https://www.ti.com/lit/ds/symlink/txb0104.pdf?ts=1738584719537&ref_url=https%253A%252F%252Fwww.mouser.com%252F; LatestRevisionDate: 2025-02-04; Published: 2025-02-04; Footprint Doc: 12-UFQFN; Value: TXB0104; Supplier 1: Digi-Key; Supplier Part Number 1: 296-25888-2-ND; Supplier 2: Mouser; Supplier Part Number 2: 595-TXB0104RUTR; Part number IPS: N.A.; Part number Norautron: N.A.; PartId: 101900856

## Sheet pca10156_sheet5_misc.SchDoc: =BoardTitle+' - Misc'
size A3; Organization: Nordic Semiconductor; DocumentNumber: 5; Revision: 1.0.0; SheetNumber: 5; SheetTotal: 8; Author: STL1; CompanyName: Nordic Semiconductor; DrawnBy: STL1; DocumentSize: A4
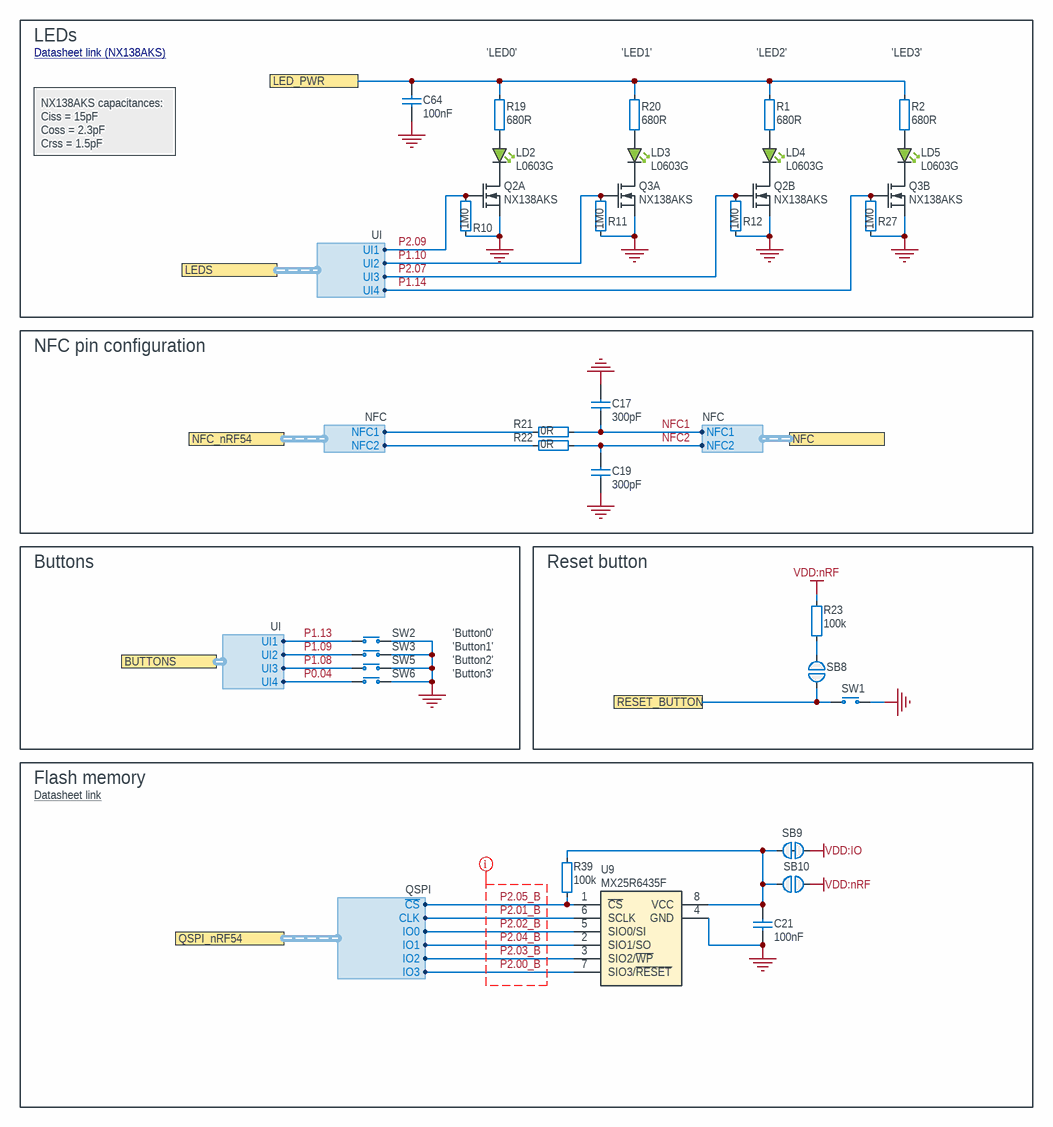
[diagram p4: pca10156_sheet5_misc.SchDoc]

### Parts
C17  300pF  [CAPC1005X04L]
C19  300pF  [CAPC1005X04L]
C21  100nF  [CAPC0603X03L_C]
C64  100nF  [CAPC0603X03L_C]
LD2  L0603G  [LED_0603_G]
LD3  L0603G  [LED_0603_G]
LD4  L0603G  [LED_0603_G]
LD5  L0603G  [LED_0603_G]
Q2  NX138AKS  [TSSOP6]  (parts A,B of 2)
Q3  NX138AKS  [TSSOP6]  (parts A,B of 2)
R1  680R  [RESC0603X03L_C]
R2  680R  [RESC0603X03L_C]
R10  1M0  [RESC0603X03L_C]
R11  1M0  [RESC0603X03L_C]
R12  1M0  [RESC0603X03L_C]
R19  680R  [RESC0603X03L_C]
R20  680R  [RESC0603X03L_C]
R21  0R  [RESC1005X04L]
R22  0R  [RESC1005X04L]
R23  100k  [RESC0603X03L_C]
R27  1M0  [RESC0603X03L_C]
R39  100k  [RESC0603X03L_C]
SB8  Solderbridge  [Solderbridge]  (value not drawn)  (no BOM)
SB9  Solderbridge  [Solderbridge_Shorted]  (value not drawn)  (net tie, no BOM)
SB10  Solderbridge  [Solderbridge]  (value not drawn)  (no BOM)
SW1  PB SW  [Switch-PB-6.2x6.3mm-SMD]  (value not drawn)
SW2  PB SW  [Switch-PB-6.2x6.3mm-SMD]  (value not drawn)
SW3  PB SW  [Switch-PB-6.2x6.3mm-SMD]  (value not drawn)
SW5  PB SW  [Switch-PB-6.2x6.3mm-SMD]  (value not drawn)
SW6  PB SW  [Switch-PB-6.2x6.3mm-SMD]  (value not drawn)
U9  MX25R6435F  [SON127P600X80_HS-9N]

### Blocks framed on the sheet
LEDs: C64 LD2-LD5 Q2 Q3 R1 R2 R10-R12 R19 R20 R27
NFC pin configuration: C17 C19 R21 R22
Buttons: SW2 SW3 SW5 SW6
Reset button: R23 SB8 SW1
Flash memory: C21 R39 SB9 SB10 U9

### Ports
BUTTONS (harness UI), LED_PWR, LEDS (harness UI), NFC (harness NFC), NFC_nRF54 (harness NFC), QSPI_nRF54 (harness QSPI), RESET_BUTTON

### Harnesses
NFC: NFC2, NFC1
UI: UI2, UI1, UI3, UI4
UI: UI2, UI3, UI4, UI1
QSPI: ~{CS}, IO0, CLK, IO1, IO2, IO3

### Nets
GND: C17.2 C19.1 C21.2 C64.1 Q2.1(S1) Q2.4(S2) Q3.1(S1) Q3.4(S2) R10.2 R11.2 R12.2 R27.2 SW1.1(N.O) SW2.1(N.O) SW3.1(N.O) SW5.1(N.O) SW6.1(N.O) U9.4(GND) U9.9(GND)
VDD:IO: SB9.1
VDD:nRF: R23.2 SB10.1
NFC1: C17.1 R21.2 ; port NFC.NFC1
NFC2: C19.2 R22.2 ; port NFC.NFC2
P0.04: SW6.2(COM) ; port BUTTONS.UI4
P1.02/NFC1: R21.1 ; port NFC_nRF54.NFC1
P1.03/NFC2: R22.1 ; port NFC_nRF54.NFC2
P1.08: SW5.2(COM) ; port BUTTONS.UI3
P1.09: SW3.2(COM) ; port BUTTONS.UI2
P1.10: Q3.2(G1) R11.1 ; port LEDS.UI2
P1.13: SW2.2(COM) ; port BUTTONS.UI1
P1.14: Q3.5(G2) R27.1 ; port LEDS.UI4
P2.00_B: U9.7(SIO3/~{RESET}) ; port QSPI_nRF54.IO3
P2.01_B: U9.6(SCLK) ; port QSPI_nRF54.CLK
P2.02_B: U9.5(SIO0/SI) ; port QSPI_nRF54.IO0
P2.03_B: U9.3(SIO2/~{WP}) ; port QSPI_nRF54.IO2
P2.04_B: U9.2(SIO1/SO) ; port QSPI_nRF54.IO1
P2.05_B: R39.1 U9.1(~{CS}) ; port QSPI_nRF54.~{CS}
P2.07: Q2.5(G2) R12.1 ; port LEDS.UI3
P2.09: Q2.2(G1) R10.1 ; port LEDS.UI1
NetC21_1: C21.1 R39.2 SB9.2 SB10.2 U9.8(VCC)
NetC64_2: C64.2 R1.2 R2.2 R19.2 R20.2 ; port LED_PWR
NetLD2_1: LD2.1(C) Q2.6(D1)
NetLD2_2: LD2.2(A) R19.1
NetLD3_1: LD3.1(C) Q3.6(D1)
NetLD3_2: LD3.2(A) R20.1
NetLD4_1: LD4.1(C) Q2.3(D2)
NetLD4_2: LD4.2(A) R1.1
NetLD5_1: LD5.1(C) Q3.3(D2)
NetLD5_2: LD5.2(A) R2.1
NetR23_1: R23.1 SB8.2
NetSB1_2: SB8.1 SW1.2(COM) ; port RESET_BUTTON

### Layout directives
net class QSPI: P2.00_B, P2.01_B, P2.02_B, P2.03_B, P2.04_B, P2.05_B

### Notes on the sheet
- Datasheet link (NX138AKS) <https://assets.nexperia.com/documents/data-sheet/NX138AKS.pdf>
- (near R19) 'LED0'
- (near R20) 'LED1'
- (near R1) 'LED2'
- (near R2) 'LED3'
- NX138AKS capacitances:
  Ciss = 15pF
  Coss = 2.3pF
  Crss = 1.5pF
- 'Button0'
- 'Button1'
- 'Button2'
- 'Button3'
- Datasheet link <https://www.mxic.com.tw/Lists/Datasheet/Attachments/8868/MX25R6435F,%20Wide%20Range,%2064Mb,%20v1.6.pdf>
- Title
- Size
- Date:
- File:
- A3
- PCB Assembly Number
- Sheet
- Drawn By:
- Revision
- of
- Classification:

### Library data of the parts
C17 C19 = C0402-300p: Capacitor, C0G, ±5%, 50V; Manufacturer: N.A.; Part number IPS: 00000007788; Part number NEMS: 100200155; Artikkelnr Noca: 20020004; Pad Count: 2; Component Status: Active; Part Number: C0402-300p; Manufacturer Part Number: N.A.; Footprint Doc: 0402; LatestRevisionDate: 2020-10-13; Published: 2015-05-29; Value: 300pF; Note: 50V; ComponentLink1URL: N.A.; ComponentLink1Description: Datasheet; ComponentLink2URL: N.A.; ComponentLink2Description: Supplier link; HelpURL: N.A.; Supplier 1: Digi-Key; Supplier Part Number 1: 490-3234-1-ND; Supplier 2: N.A.; Supplier Part Number 2: N.A.; Component Class: Capacitors; PartId: 100200155; Author: rsk; Part number Norautron: N.A.
C21 = C0201-100n: as C13 on sheet pca10156_sheet3_debugger; Part Number: C0201-100n; Value: 100nF; Footprint Doc: 0201; Component Class: Capacitors; Author: rsk; PartId: 100200078; Manufacturer Part Number: N.A.; ComponentLink1URL: N.A.; ComponentLink1Description: Datasheet; ComponentLink2URL: N.A.; ComponentLink2Description: Supplier link; HelpURL: N.A.; LatestRevisionDate: 2017-11-09; Published: 2014-11-13; Supplier 1: N.A.; Supplier Part Number 1: N.A.; Supplier 2: N.A.; Supplier Part Number 2: N.A.; Artikkelnr Noca: N.A.
C64 = C0201-100n: Capacitor, X5R, ±10%; Manufacturer: N.A.; Part number IPS: 00000001248, 00000002505; Part number Norautron: 262071862; Part number NEMS: 100200078; Note: 16V; Pad Count: 2; Component Status: Active; Part Number: C0201-100n; Manufacturer Part Number: N.A.; LatestRevisionDate: 2017-11-09; Published: 2014-11-13; Value: 100nF; Artikkelnr Noca: N.A.; Footprint Doc: 0201; ComponentLink1URL: N.A.; ComponentLink1Description: Datasheet; ComponentLink2URL: N.A.; ComponentLink2Description: Supplier link; HelpURL: N.A.; Supplier 1: N.A.; Supplier Part Number 1: N.A.; Supplier 2: N.A.; Supplier Part Number 2: N.A.; Component Class: Capacitors; PartId: 100200078; Author: rsk
LD2-LD5 = VS 25C7M5: as LD1 on sheet pca10156_sheet3_debugger; Part Number: VS 25C7M5; PartId: 101400097; Component Class: Optoelectronics; Author: rsk; Manufacturer Part Number: VS 25C7M5; ComponentLink1URL: N.A.; ComponentLink1Description: Datasheet; ComponentLink2URL: N.A.; ComponentLink2Description: Supplier link; HelpURL: \\hizz\pro\app9717\Datasheet\optoelectronics\Victory Electronics\VS 25C7M5.pdf; Footprint Doc: 0603; LatestRevisionDate: 2020-10-23; Published: 2017-08-21; Value: L0603G; Supplier 1: EC Partner; Supplier Part Number 1: N.A.; Supplier 2: N.A.; Supplier Part Number 2: N.A.
Q2 Q3 = NX138AKS: as Q1 on sheet pca10156_sheet3_debugger; Part Number: NX138AKS; Component Class: Semiconductors; Author: stl1; ComponentLink1URL: https://assets.nexperia.com/documents/data-sheet/NX138AKS.pdf; ComponentLink1Description: Datasheet; ComponentLink2URL: N.A.; ComponentLink2Description: Supplier link; HelpURL: N.A.; LatestRevisionDate: 2023-11-20; Published: 2023-11-20; Footprint Doc: TSSOP6; Value: NX138AKS; Supplier 1: Digi-Key; Supplier Part Number 1: 1727-2732-2-ND; Supplier 2: Mouser; Supplier Part Number 2: 771-NX138AKSX; Artikkelnr Noca: N.A.; Part number IPS: N.A.; Part number Norautron: N.A.; PartId: 101300207
R1 R2 R19 R20 = R0201-680: Resistor, ±1%, 0.05W; Manufacturer: N.A.; Part number NEMS: 100100040; Component Status: Active; Pad Count: 2; Note: Chip Res 1%; Part Number: R0201-680; PartId: 100100040; Component Class: Resistors; Author: rsk; Manufacturer Part Number: N.A.; ComponentLink1URL: N.A.; ComponentLink1Description: Datasheet; ComponentLink2URL: N.A.; ComponentLink2Description: Supplier link; HelpURL: N.A.; LatestRevisionDate: 2014-11-13; Published: 2014-11-13; Footprint Doc: 0201; Value: 680R; Supplier 1: N.A.; Supplier Part Number 1: N.A.; Supplier 2: N.A.; Supplier Part Number 2: N.A.; Artikkelnr Noca: N.A.; Part number IPS: N.A.; Part number Norautron: N.A.
R10-R12 R27 = R0201-1M0: as R18 on sheet pca10156_sheet4_level_shifters; Part Number: R0201-1M0; PartId: 100100093; Component Class: Resistors; Author: rsk; Manufacturer Part Number: N.A.; ComponentLink1URL: N.A.; ComponentLink1Description: Datasheet; ComponentLink2URL: N.A.; ComponentLink2Description: Supplier link; HelpURL: N.A.; LatestRevisionDate: 2014-11-13; Published: 2014-11-13; Footprint Doc: 0201; Value: 1M0; Supplier 1: N.A.; Supplier Part Number 1: N.A.; Supplier 2: N.A.; Supplier Part Number 2: N.A.; Artikkelnr Noca: N.A.
R21 R22 = R0402-0R: as R25 on sheet pca10156_sheet4_level_shifters; Part Number: R0402-0R; PartId: 100100109; Component Class: Resistors; Author: rsk; Manufacturer Part Number: N.A.; ComponentLink1URL: N.A.; ComponentLink1Description: Datasheet; ComponentLink2URL: N.A.; ComponentLink2Description: Supplier link; HelpURL: N.A.; LatestRevisionDate: 2009-11-23; Published: 2009-05-08; Footprint Doc: 0402; Value: 0R; Supplier 1: Farnell; Supplier Part Number 1: 146-9661; Supplier 2: N.A.; Supplier Part Number 2: N.A.; Part number Norautron: N.A.
R23 R39 = R0201-100k: as R6 on sheet pca10156_sheet3_debugger; Part Number: R0201-100k; Manufacturer Part Number: N.A.; Footprint Doc: 0201; LatestRevisionDate: 2014-11-13; Published: 2014-11-13; Value: 100k; Artikkelnr Noca: N.A.; ComponentLink1URL: N.A.; ComponentLink1Description: Datasheet; ComponentLink2URL: N.A.; ComponentLink2Description: Supplier link; HelpURL: N.A.; Supplier 1: N.A.; Supplier Part Number 1: N.A.; Supplier 2: N.A.; Supplier Part Number 2: N.A.; Component Class: Resistors; PartId: 100100080; Author: rsk
SB8 SB10 = Solderbridge: Manufacturer: N.A.; Part number NEMS: 100500458; Pad Count: 2; Component Status: Active; System: Connector; Part Number: Solderbridge; Manufacturer Part Number: N.A.; LatestRevisionDate: 2009-12-14; Published: 2009-12-14; Value: Solderbridge; Note: N.A.; Artikkelnr Noca: N.A.; Footprint Doc: Solderbridge; Part number IPS: N.A.; ComponentLink1URL: N.A.; ComponentLink1Description: Datasheet; ComponentLink2URL: N.A.; ComponentLink2Description: Supplier link; HelpURL: N.A.; Supplier 1: N.A.; Supplier Part Number 1: N.A.; Supplier 2: N.A.; Supplier Part Number 2: N.A.; Component Class: Connectors; PartId: 100500458; Author: rsk; Part number Norautron: N.A.
SB9 = Solderbridge Shorted: Shorted Solderbridge; Manufacturer: N.A.; Part number NEMS: 100500459; Pad Count: 2; Component Status: Active; System: Connector; Part Number: Solderbridge Shorted; Manufacturer Part Number: N.A.; LatestRevisionDate: 2012-08-07; Published: 2012-08-07; Value: Solderbridge; Note: N.A.; Artikkelnr Noca: N.A.; Footprint Doc: Solderbridge_Shorted; Part number IPS: N.A.; ComponentLink1URL: N.A.; ComponentLink1Description: Datasheet; ComponentLink2URL: N.A.; ComponentLink2Description: Supplier link; HelpURL: N.A.; Supplier 1: N.A.; Supplier Part Number 1: N.A.; Supplier 2: N.A.; Supplier Part Number 2: N.A.; Component Class: Connectors; PartId: 100500459; Author: rsk; Part number Norautron: N.A.
SW1-SW3 SW5 SW6 = Switch-PB-6.2x6.3mm-SMD: Tactile Switch, SPNO, SMD, 160gf, 6.2x6.3x2.5mm; Manufacturer: Dailywell; Manufacturer Part Number: TS604VM1-025BR-R; Part number IPS: 00000007812; Part number NEMS: 101500001, 101500133; Note: N.A.; Artikkelnr Noca: 50019106; Pad Count: 4; Component Status: Active; Part Number: Switch-PB-6.2x6.3mm-SMD; Footprint Doc: Switch-PB-6.2x6.3mm-SMD; LatestRevisionDate: 2016-04-21; Published: 2010-02-01; Value: PB SW; ComponentLink1URL: N.A.; ComponentLink1Description: Datasheet; ComponentLink2URL: N.A.; ComponentLink2Description: Supplier link; HelpURL: \\hizz\pro\app9717\Datasheet\switches\Dailywell\TS604VM1-025BR-R.pdf; Supplier 1: Cabcon; Supplier Part Number 1: TS604VM1-025BR-R; Supplier 2: Mouser; Supplier Part Number 2: 688-SKHUALE010; Component Class: Switches; PartId: 101500001; Author: rsk; Part number Norautron: N.A.
U9 = MX25R6435FZNIL0: Ultra low power, 64M-bit, serial multi I/O flash memory; Manufacturer: Macronix; Part number IPS: 00000004370; Part number NEMS: 101900438; Note: N.A.; Artikkelnr Noca: 15020015; Pad Count: 8; Component Status: Active; Part Number: MX25R6435FZNIL0; Manufacturer Part Number: MX25R6435FZNIL0; Footprint Doc: WSON-8; LatestRevisionDate: 2021-02-26; Published: 2016-06-29; Value: MX25R6435F; ComponentLink1URL: N.A.; ComponentLink1Description: Datasheet; ComponentLink2URL: N.A.; ComponentLink2Description: Supplier link; HelpURL: https://www.macronix.com/Lists/Datasheet/Attachments/7913/MX25R6435F,%20Wide%20Range,%2064Mb,%20v1.5.pdf; Supplier 1: Future; Supplier Part Number 1: MX25R6435FZNIL0; Supplier 2: Arrow; Supplier Part Number 2: MX25R6435FZNIL0; Component Class: Misc_ICs; PartId: 101900438; Author: rsk; Part number Norautron: N.A.